# Altium schematic sheet Sensor shoot.SchDoc
size A
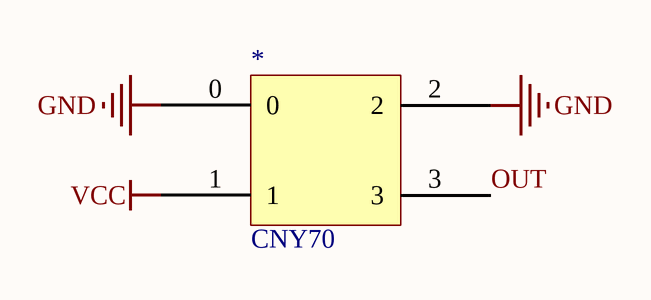
[diagram p0: Sensor shoot.SchDoc]

## Parts
*  CNY70  [CNY70]

## Nets
GND: *.0 *.2
VCC: *.1
OUT: *.3